# EAGLE schematic Controller Rev 2 (EAGLE 6.1)
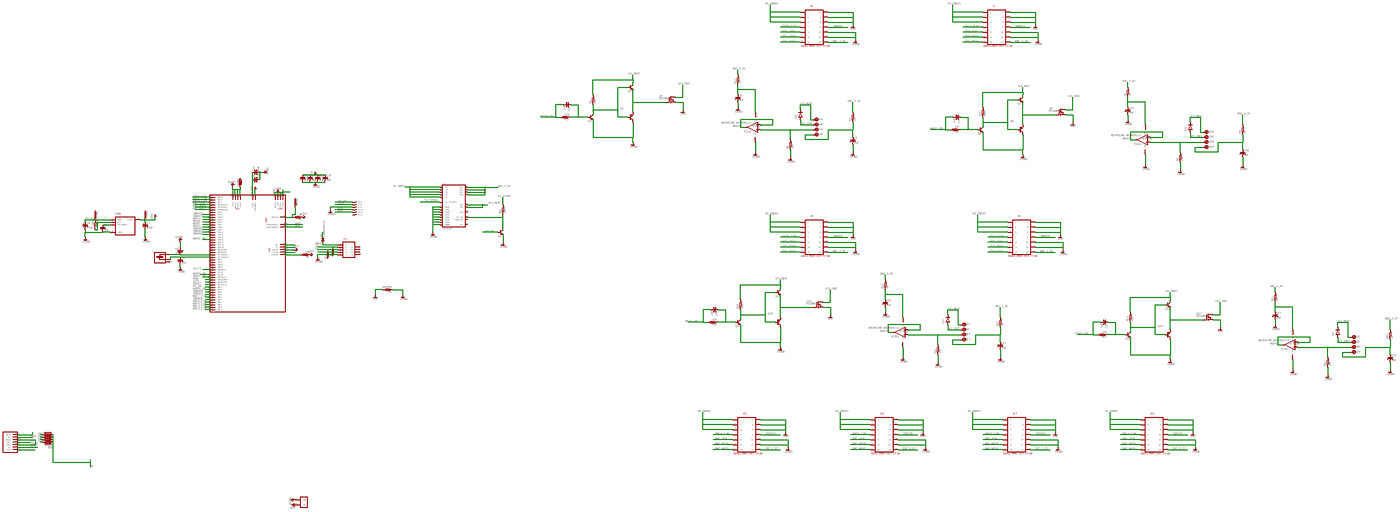
[diagram p0: schematic, sheet 1, overview]
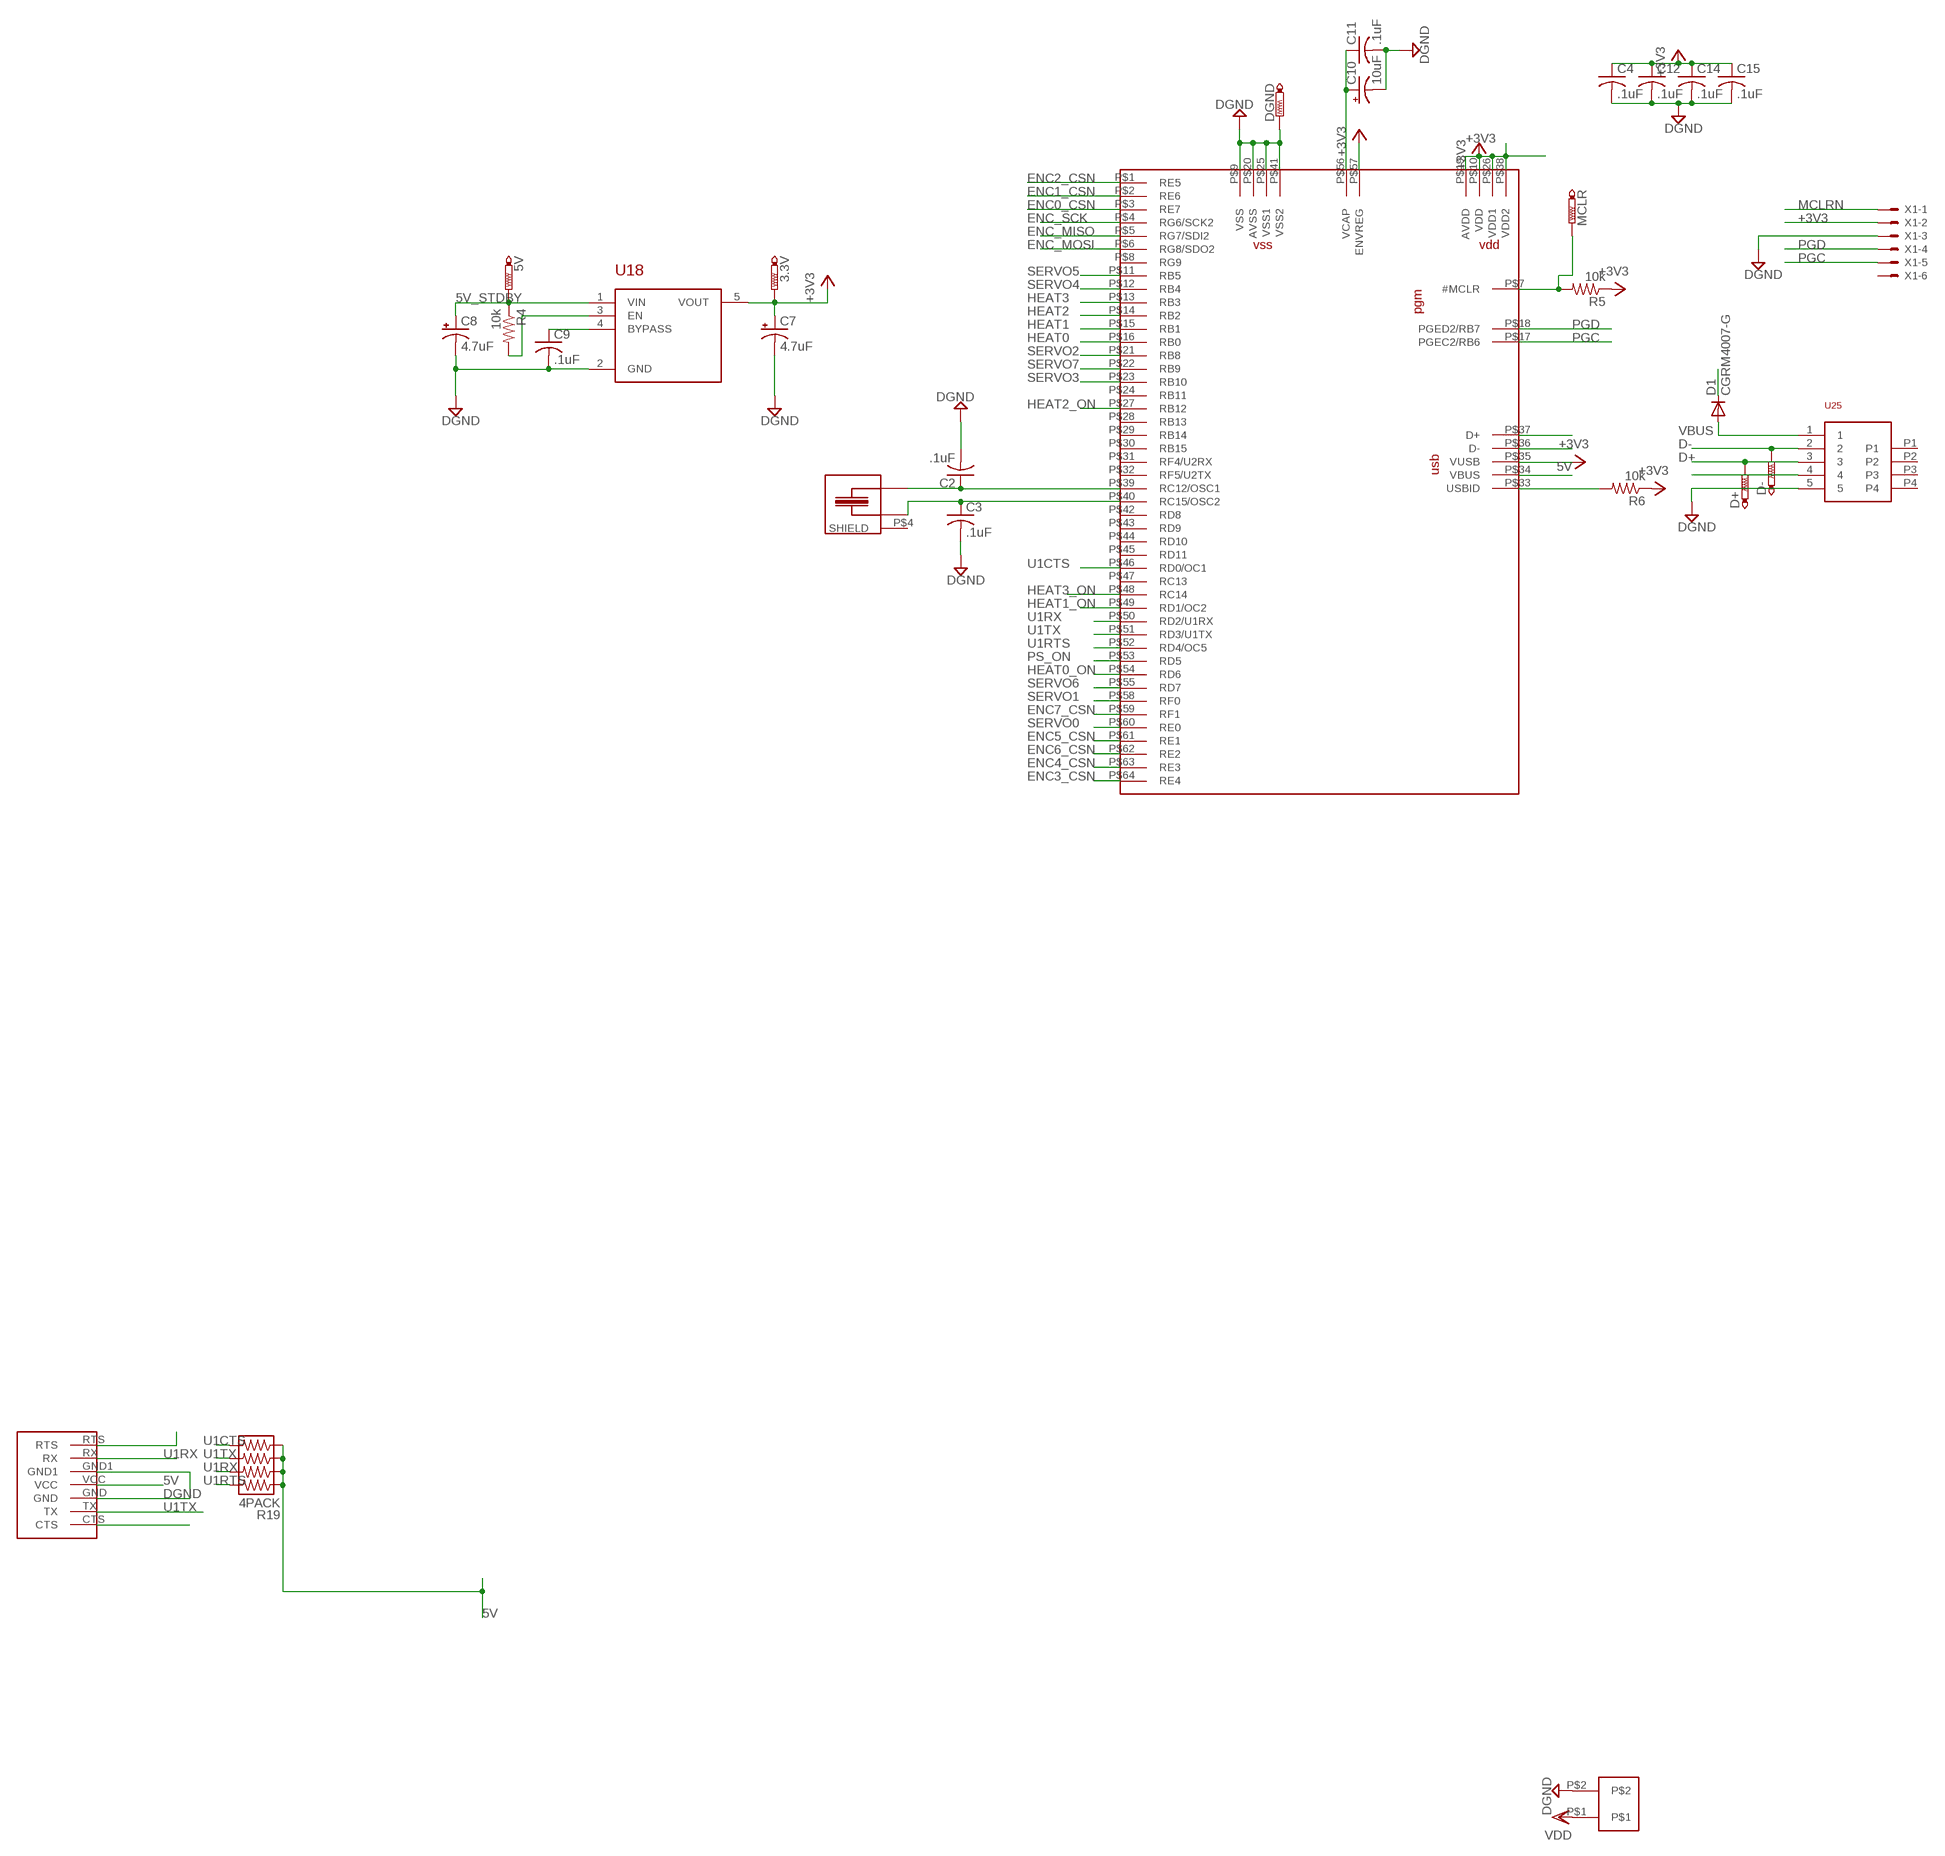
[diagram p1: schematic, sheet 1, part 1 of 4]
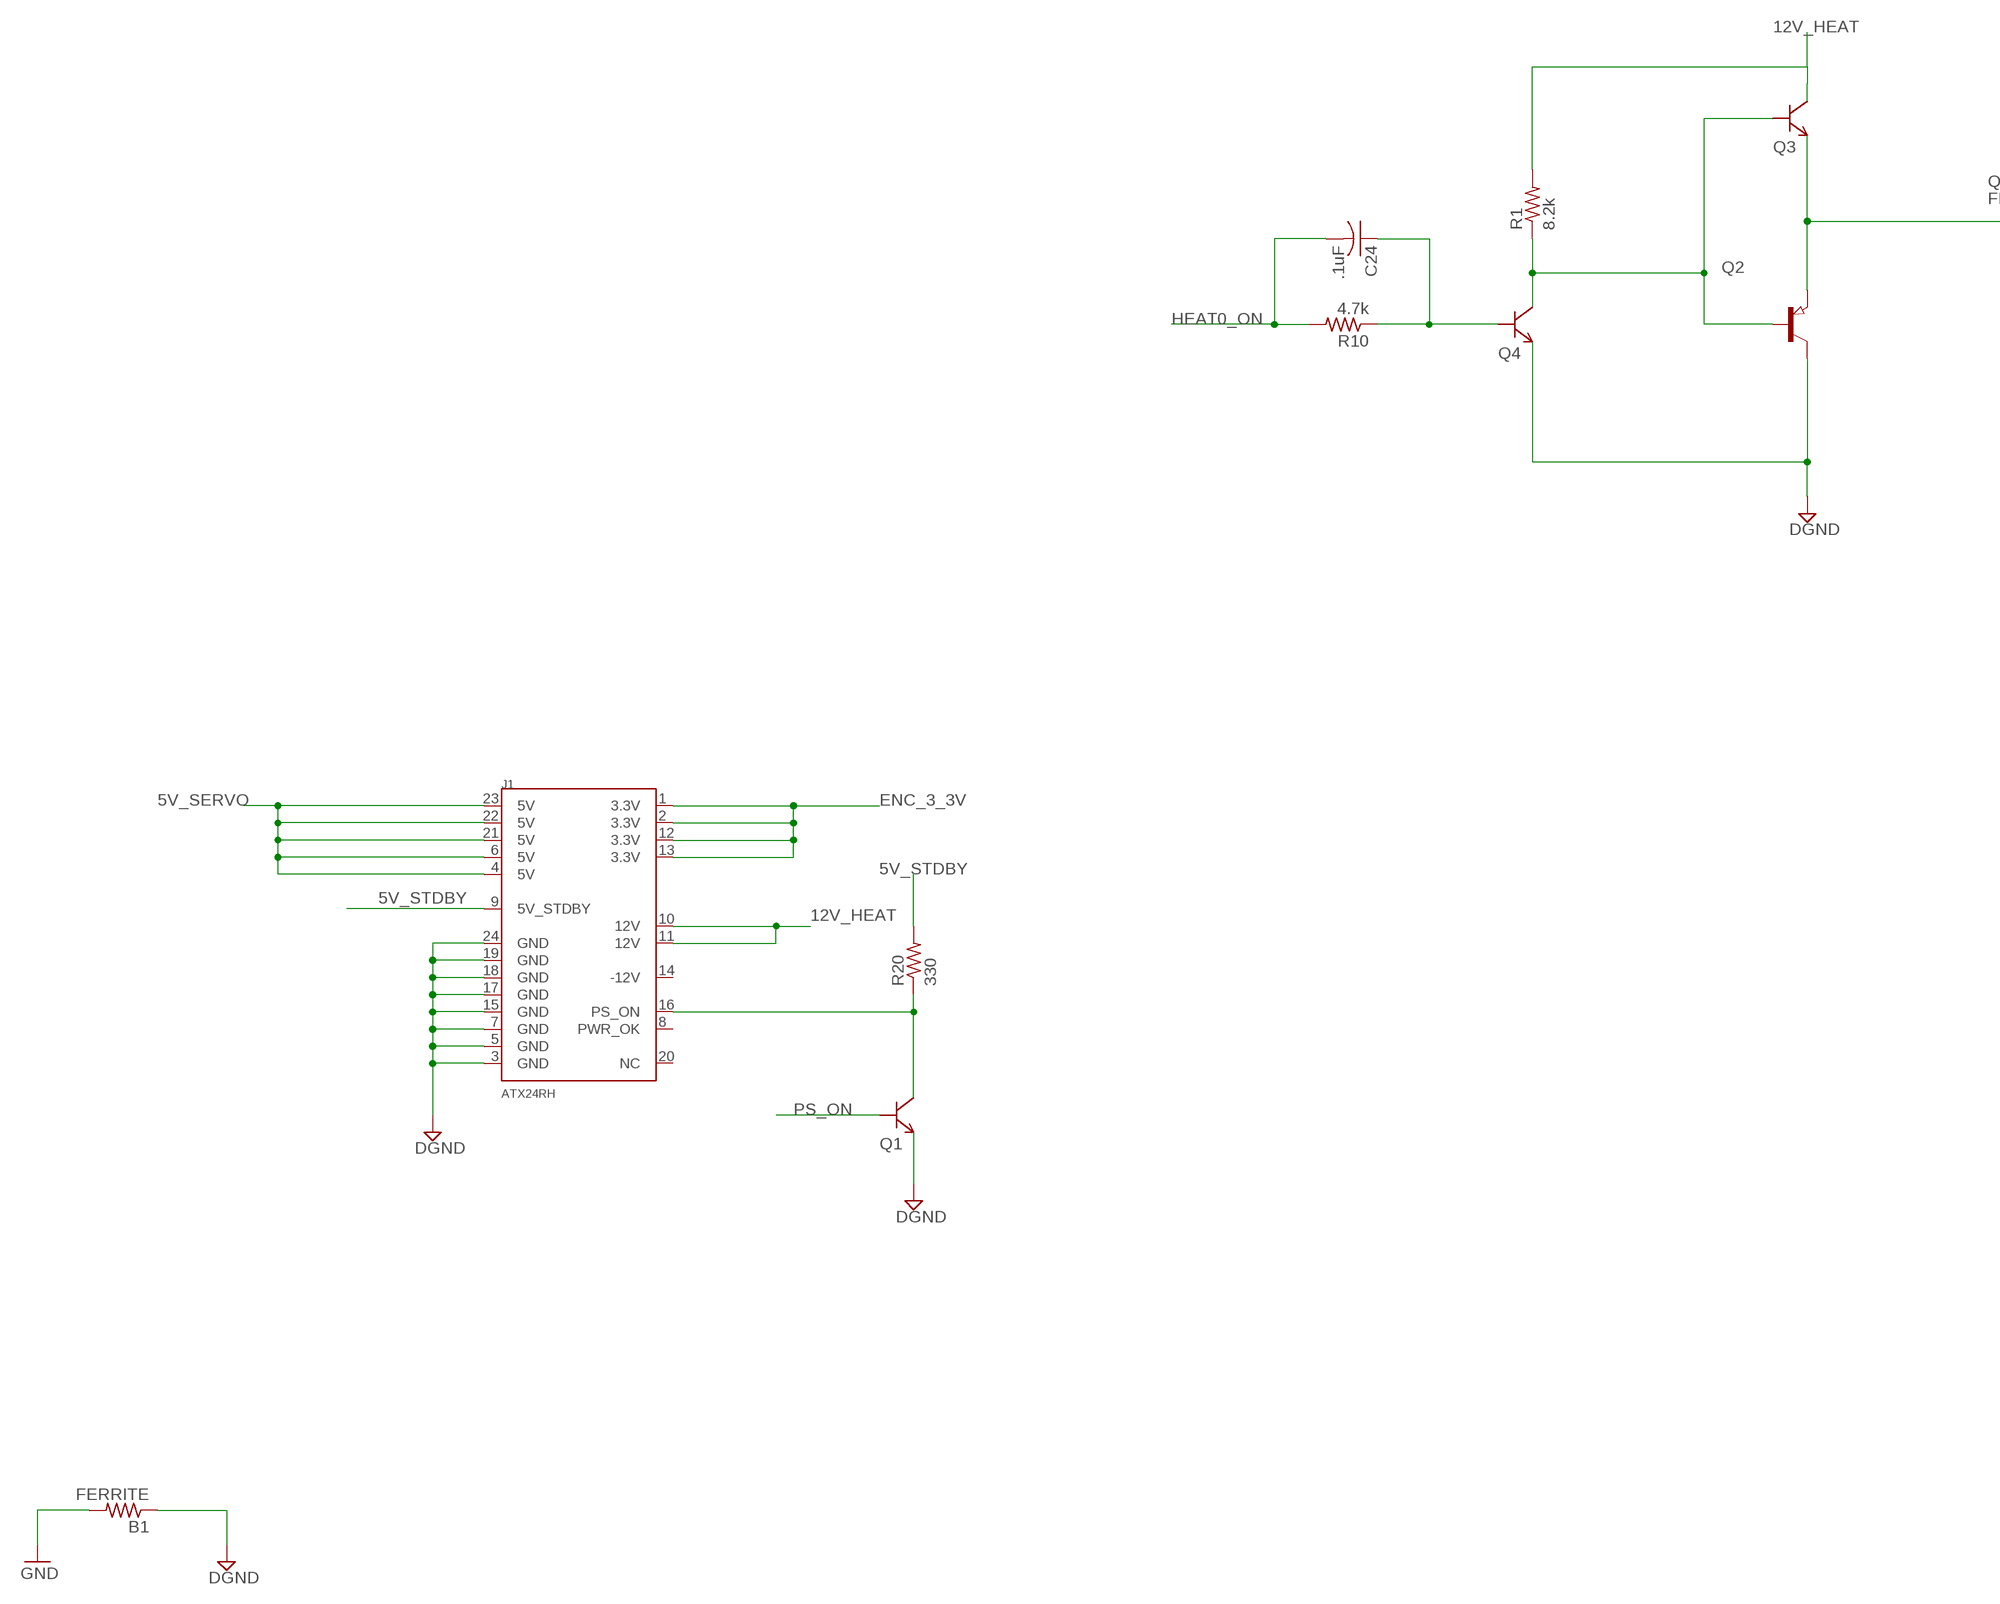
[diagram p2: schematic, sheet 1, part 2 of 4]
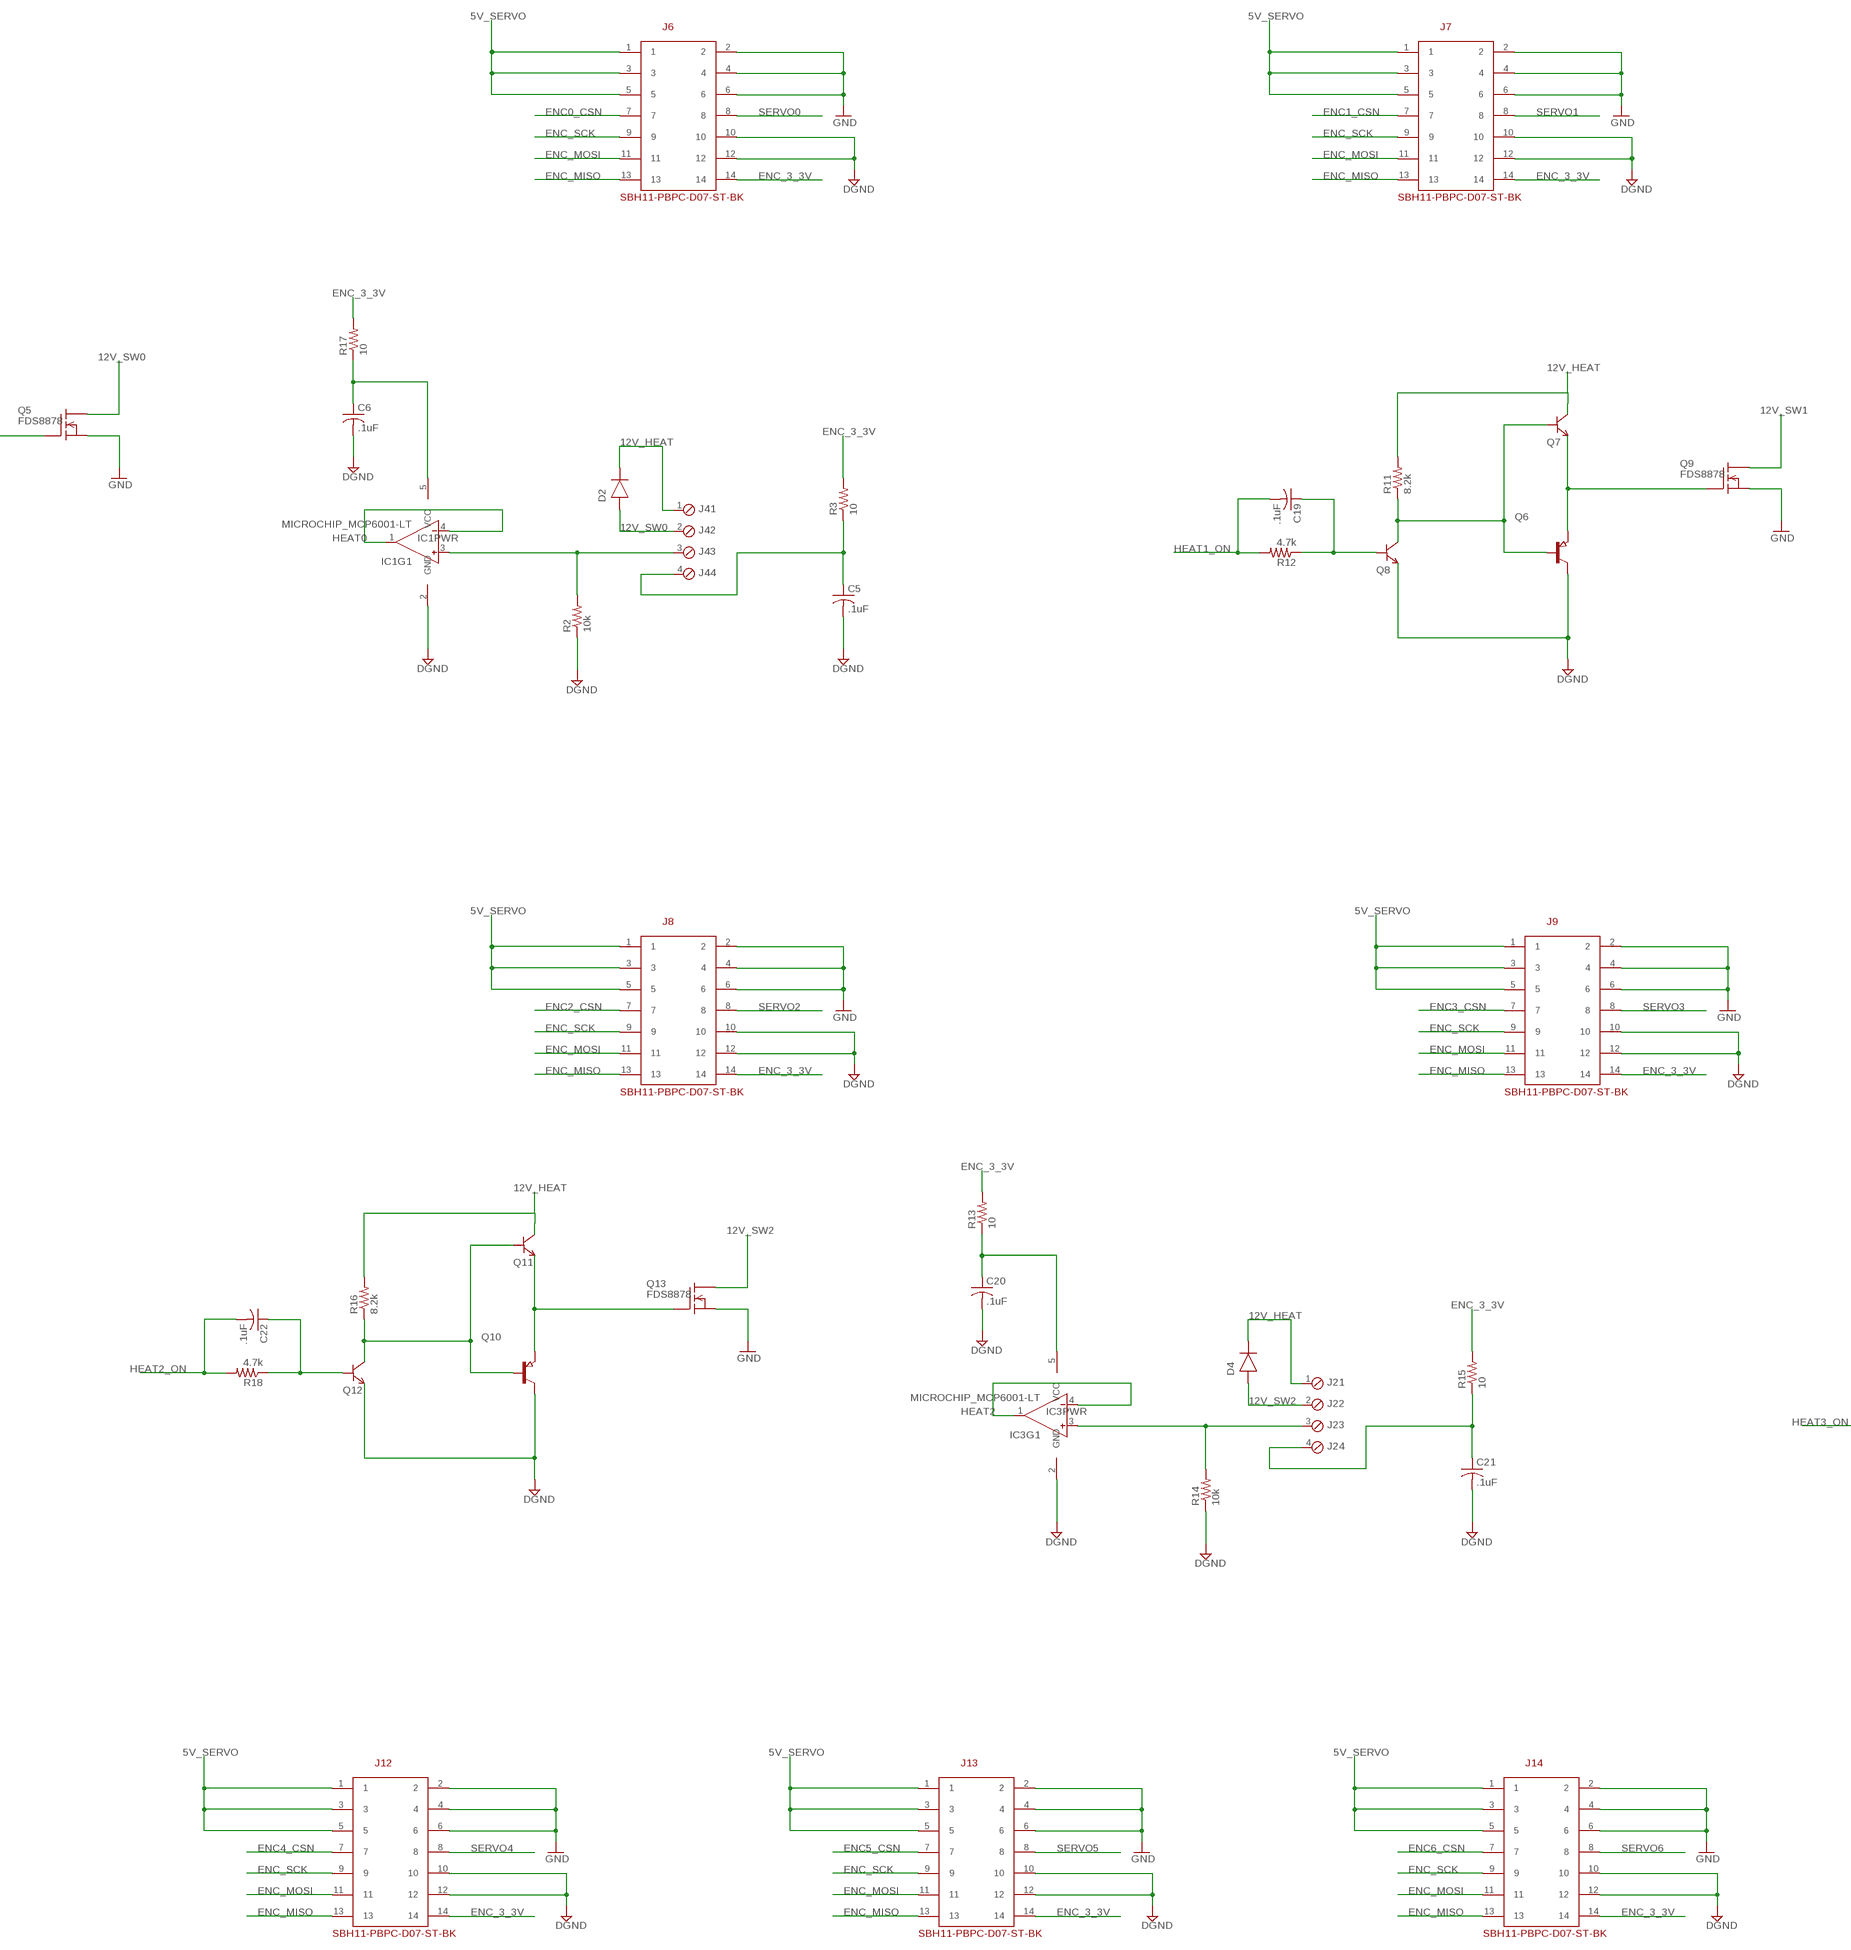
[diagram p3: schematic, sheet 1, part 3 of 4]
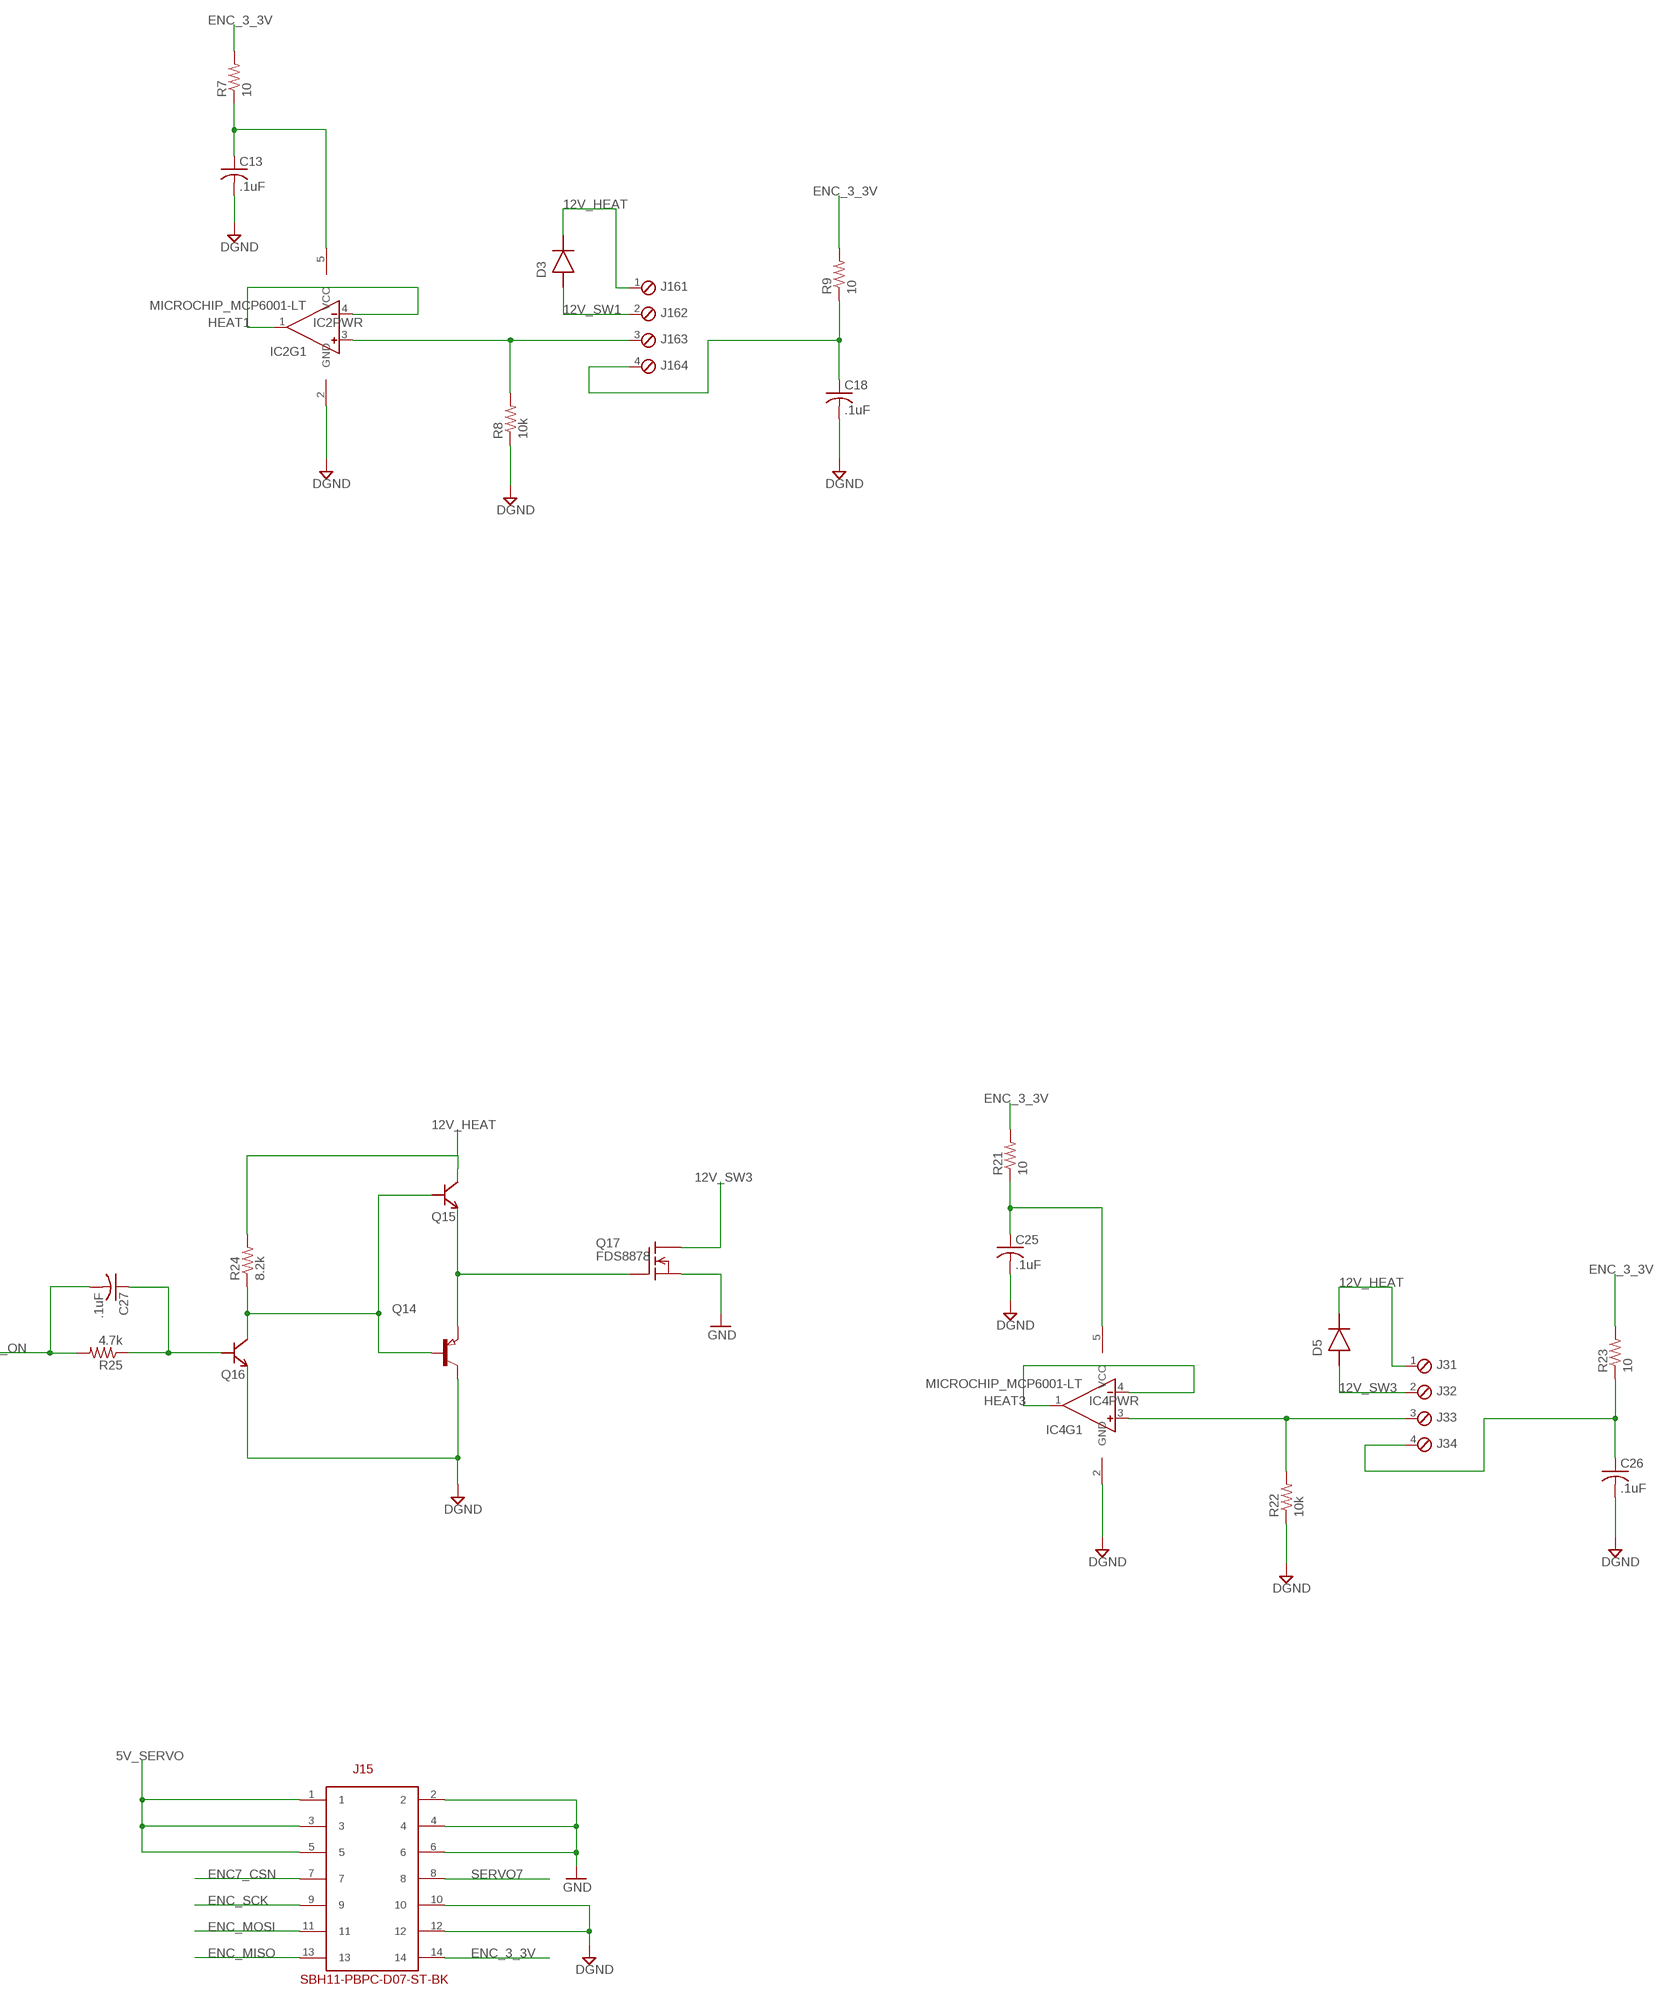
[diagram p4: schematic, sheet 1, part 4 of 4]

## Parts
3.3V  PTR1TP14R  [TP14R]
5V  PTR1TP14R  [TP14R]
B1  FERRITE  R-US_R0603  [R0603]
C2  .1uF  C-USC0603  [C0603]
C3  .1uF  C-USC0603  [C0603]
C4  .1uF  C-USC0603  [C0603]
C5  .1uF  C-USC0603  [C0603]
C6  .1uF  C-USC0603  [C0603]
C7  4.7uF  CPOL-USR/2012-12R  [R/2012-12R]
C8  4.7uF  CPOL-USR/2012-12R  [R/2012-12R]
C9  .1uF  C-USC0402  [C0402]
C10  10uF  CPOL-USR/2012-12R  [R/2012-12R]
C11  .1uF  C-USC0603  [C0603]
C12  .1uF  C-USC0603  [C0603]
C13  .1uF  C-USC0603  [C0603]
C14  .1uF  C-USC0603  [C0603]
C15  .1uF  C-USC0603  [C0603]
C18  .1uF  C-USC0603  [C0603]
C19  .1uF  C-USC0603  [C0603]
C20  .1uF  C-USC0603  [C0603]
C21  .1uF  C-USC0603  [C0603]
C22  .1uF  C-USC0603  [C0603]
C24  .1uF  C-USC0603  [C0603]
C25  .1uF  C-USC0603  [C0603]
C26  .1uF  C-USC0603  [C0603]
C27  .1uF  C-USC0603  [C0603]
D1  CGRM4007-G  [SOD-123_MINI-SMA]
D2  DISCRETE_DIODESMA  [DISCRETE_SMA]
D3  DISCRETE_DIODESMA  [DISCRETE_SMA]
D4  DISCRETE_DIODESMA  [DISCRETE_SMA]
D5  DISCRETE_DIODESMA  [DISCRETE_SMA]
D+  PTR1TP14R  [TP14R]
D-  PTR1TP14R  [TP14R]
DGND  PTR1B1,27  [B1,27]
IC1  MICROCHIP_MCP6001-LT  [MICROCHIP_SC70-5-LT]
IC2  MICROCHIP_MCP6001-LT  [MICROCHIP_SC70-5-LT]
IC3  MICROCHIP_MCP6001-LT  [MICROCHIP_SC70-5-LT]
IC4  MICROCHIP_MCP6001-LT  [MICROCHIP_SC70-5-LT]
J1  ATX24RH  [ATX24_RIGHT_ANGLE]
J2  OSTVN04A150  [4POL254]
J3  OSTVN04A150  [4POL254]
J4  OSTVN04A150  [4POL254]
J6  SBH11-PBPC-D07-ST-BK  [SBH11-PBPC-D07-ST-BK]
J7  SBH11-PBPC-D07-ST-BK  [SBH11-PBPC-D07-ST-BK]
J8  SBH11-PBPC-D07-ST-BK  [SBH11-PBPC-D07-ST-BK]
J9  SBH11-PBPC-D07-ST-BK  [SBH11-PBPC-D07-ST-BK]
J10  WASP7PIN  [WASP7PIN]
J12  SBH11-PBPC-D07-ST-BK  [SBH11-PBPC-D07-ST-BK]
J13  SBH11-PBPC-D07-ST-BK  [SBH11-PBPC-D07-ST-BK]
J14  SBH11-PBPC-D07-ST-BK  [SBH11-PBPC-D07-ST-BK]
J15  SBH11-PBPC-D07-ST-BK  [SBH11-PBPC-D07-ST-BK]
J16  OSTVN04A150  [4POL254]
MCLR  PTR1TP14R  [TP14R]
Q1  DISCRETE_MMBT3904LT1G  [DISCRETE_SOT23]
Q2  PNP-TRANSISTOR_SOT23  [SOT23]
Q3  DISCRETE_MMBT3904LT1G  [DISCRETE_SOT23]
Q4  DISCRETE_MMBT3904LT1G  [DISCRETE_SOT23]
Q5  FDS8878  FDS5680  [SO-8]
Q6  PNP-TRANSISTOR_SOT23  [SOT23]
Q7  DISCRETE_MMBT3904LT1G  [DISCRETE_SOT23]
Q8  DISCRETE_MMBT3904LT1G  [DISCRETE_SOT23]
Q9  FDS8878  FDS5680  [SO-8]
Q10  PNP-TRANSISTOR_SOT23  [SOT23]
Q11  DISCRETE_MMBT3904LT1G  [DISCRETE_SOT23]
Q12  DISCRETE_MMBT3904LT1G  [DISCRETE_SOT23]
Q13  FDS8878  FDS5680  [SO-8]
Q14  PNP-TRANSISTOR_SOT23  [SOT23]
Q15  DISCRETE_MMBT3904LT1G  [DISCRETE_SOT23]
Q16  DISCRETE_MMBT3904LT1G  [DISCRETE_SOT23]
Q17  FDS8878  FDS5680  [SO-8]
R1  8.2k  R-US_R0603  [R0603]
R2  10k  R-US_R0603  [R0603]
R3  10  R-US_R0603  [R0603]
R4  10k  R-US_R0402  [R0402]
R5  10k  R-US_R0603  [R0603]
R6  10k  R-US_R0603  [R0603]
R7  10  R-US_R0603  [R0603]
R8  10k  R-US_R0603  [R0603]
R9  10  R-US_R0603  [R0603]
R10  4.7k  R-US_R0603  [R0603]
R11  8.2k  R-US_R0603  [R0603]
R12  4.7k  R-US_R0603  [R0603]
R13  10  R-US_R0603  [R0603]
R14  10k  R-US_R0603  [R0603]
R15  10  R-US_R0603  [R0603]
R16  8.2k  R-US_R0603  [R0603]
R17  10  R-US_R0603  [R0603]
R18  4.7k  R-US_R0603  [R0603]
R19  4PACK  [4PACK_0603]
R20  330  R-US_R0603  [R0603]
R21  10  R-US_R0603  [R0603]
R22  10k  R-US_R0603  [R0603]
R23  10  R-US_R0603  [R0603]
R24  8.2k  R-US_R0603  [R0603]
R25  4.7k  R-US_R0603  [R0603]
U3  PIC32-64TQFP64-2  [TQFP64-2]
U18  LDS3985XX33  [SOT23-5]
U25  1734035-1_USB  [1734035-1_1734035]
U$19  2P  [2PTH]
X1  22-23-2061  [22-23-2061]
X2  CMR3XXT  [CMR309T]

## Nets
5V: D1.C J10.VCC R19.R1B R19.R2B R19.R3B R19.R4B U3.P$34(VBUS)
5V_SERVO: J1.4(5V) J1.6(5V) J1.21(5V) J1.22(5V) J1.23(5V) J6.1 J6.3 J6.5 J7.1 J7.3 J7.5 J8.1 J8.3 J8.5 J9.1 J9.3 J9.5 J12.1 J12.3 J12.5 J13.1 J13.3 J13.5 J14.1 J14.3 J14.5 J15.1 J15.3 J15.5
5V_STDBY: 5V.TP C8.+ J1.9(5V_STDBY) R4.1 R20.2 U18.1(VIN)
12V_HEAT: D2.C D3.C D4.C D5.C J1.10(12V) J1.11(12V) J2.1 J3.1 J4.1 J16.1 Q3.3(C) Q7.3(C) Q11.3(C) Q15.3(C) R1.2 R11.2 R16.2 R24.2
12V_SW0: D2.A J4.2 Q5.5(D) Q5.6(D) Q5.7(D) Q5.8(D)
12V_SW1: D3.A J16.2 Q9.5(D) Q9.6(D) Q9.7(D) Q9.8(D)
12V_SW2: D4.A J2.2 Q13.5(D) Q13.6(D) Q13.7(D) Q13.8(D)
12V_SW3: D5.A J3.2 Q17.5(D) Q17.6(D) Q17.7(D) Q17.8(D)
+3V3: 3.3V.TP C4.1 C7.+ C12.1 C14.1 C15.1 R5.1 R6.1 U3.P$10(VDD) U3.P$19(AVDD) U3.P$26(VDD1) U3.P$35(VUSB) U3.P$38(VDD2) U3.P$57(ENVREG) U18.5(VOUT) X1.2
D+: D+.TP U3.P$37(D+) U25.3
D-: D-.TP U3.P$36(D-) U25.2
DGND: B1.1 C2.2 C3.2 C4.2 C5.2 C6.2 C7.- C8.- C9.2 C10.- C11.2 C12.2 C13.2 C14.2 C15.2 C18.2 C20.2 C21.2 C25.2 C26.2 DGND.PP(TP) IC1.2(PWR:GND) IC2.2(PWR:GND) IC3.2(PWR:GND) IC4.2(PWR:GND) J1.3(GND) J1.5(GND) J1.7(GND) J1.15(GND) J1.17(GND) J1.18(GND) J1.19(GND) J1.24(GND) J6.10 J6.12 J7.10 J7.12 J8.10 J8.12 J9.10 J9.12 J10.GND J10.GND1 J12.10 J12.12 J13.10 J13.12 J14.10 J14.12 J15.10 J15.12 Q1.2(E) Q2.3(C) Q4.2(E) Q6.3(C) Q8.2(E) Q10.3(C) Q12.2(E) Q14.3(C) Q16.2(E) R2.1 R8.1 R14.1 R22.1 U3.P$9(VSS) U3.P$20(AVSS) U3.P$25(VSS1) U3.P$41(VSS2) U18.2(GND) U25.5 U$19.P$2 X1.3
ENC0_CSN: J6.7 U3.P$3(RE7)
ENC1_CSN: J7.7 U3.P$2(RE6)
ENC2_CSN: J8.7 U3.P$1(RE5)
ENC3_CSN: J9.7 U3.P$64(RE4)
ENC4_CSN: J12.7 U3.P$63(RE3)
ENC5_CSN: J13.7 U3.P$61(RE1)
ENC6_CSN: J14.7 U3.P$62(RE2)
ENC7_CSN: J15.7 U3.P$59(RF1)
ENC_3_3V: J1.1(3.3V) J1.2(3.3V) J1.12(3.3V) J1.13(3.3V) J6.14 J7.14 J8.14 J9.14 J12.14 J13.14 J14.14 J15.14 R3.2 R7.2 R9.2 R13.2 R15.2 R17.2 R21.2 R23.2
ENC_MISO: J6.13 J7.13 J8.13 J9.13 J12.13 J13.13 J14.13 J15.13 U3.P$5(RG7/SDI2)
ENC_MOSI: J6.11 J7.11 J8.11 J9.11 J12.11 J13.11 J14.11 J15.11 U3.P$6(RG8/SDO2)
ENC_SCK: J6.9 J7.9 J8.9 J9.9 J12.9 J13.9 J14.9 J15.9 U3.P$4(RG6/SCK2)
GND: B1.2 J6.2 J6.4 J6.6 J7.2 J7.4 J7.6 J8.2 J8.4 J8.6 J9.2 J9.4 J9.6 J12.2 J12.4 J12.6 J13.2 J13.4 J13.6 J14.2 J14.4 J14.6 J15.2 J15.4 J15.6 Q5.1(S) Q5.2(S) Q5.3(S) Q9.1(S) Q9.2(S) Q9.3(S) Q13.1(S) Q13.2(S) Q13.3(S) Q17.1(S) Q17.2(S) Q17.3(S)
HEAT0: IC1.1(OUT) IC1.4(IN-) U3.P$16(RB0)
HEAT0_ON: C24.2 R10.2 U3.P$54(RD6)
HEAT1: IC2.1(OUT) IC2.4(IN-) U3.P$15(RB1)
HEAT1_ON: C19.2 R12.2 U3.P$49(RD1/OC2)
HEAT2: IC3.1(OUT) IC3.4(IN-) U3.P$14(RB2)
HEAT2_ON: C22.2 R18.2 U3.P$27(RB12)
HEAT3: IC4.1(OUT) IC4.4(IN-) U3.P$13(RB3)
HEAT3_ON: C27.2 R25.2 U3.P$48(RC14)
MCLRN: MCLR.TP R5.2 U3.P$7(#MCLR) X1.1
N$1: C5.1 J4.4 R3.1
N$2: R4.2 U18.3(EN)
N$3: C9.1 U18.4(BYPASS)
N$4: C3.1 U3.P$40(RC15/OSC2) X2.P$3
N$5: C10.+ C11.1 U3.P$56(VCAP)
N$6: C2.1 U3.P$39(RC12/OSC1) X2.P$1
N$7: IC2.3(IN+) J16.3 R8.2
N$8: C13.1 IC2.5(PWR:VCC) R7.1
N$9: C18.1 J16.4 R9.1
N$10: IC1.3(IN+) J4.3 R2.2
N$11: Q6.1(B) Q7.1(B) Q8.3(C) R11.1
N$12: C19.1 Q8.1(B) R12.1
N$13: Q2.1(B) Q3.1(B) Q4.3(C) R1.1
N$14: C24.1 Q4.1(B) R10.1
N$15: Q6.2(E) Q7.2(E) Q9.4(G)
N$16: Q2.2(E) Q3.2(E) Q5.4(G)
N$17: IC3.3(IN+) J2.3 R14.2
N$18: C20.1 IC3.5(PWR:VCC) R13.1
N$19: C21.1 J2.4 R15.1
N$20: Q10.1(B) Q11.1(B) Q12.3(C) R16.1
N$21: C6.1 IC1.5(PWR:VCC) R17.1
N$22: C22.1 Q12.1(B) R18.1
N$23: Q10.2(E) Q11.2(E) Q13.4(G)
N$24: IC4.3(IN+) J3.3 R22.2
N$25: C25.1 IC4.5(PWR:VCC) R21.1
N$26: C26.1 J3.4 R23.1
N$27: Q14.1(B) Q15.1(B) Q16.3(C) R24.1
N$28: C27.1 Q16.1(B) R25.1
N$29: Q14.2(E) Q15.2(E) Q17.4(G)
N$32: J1.16(PS_ON) Q1.3(C) R20.1
PGC: U3.P$17(PGEC2/RB6) X1.5
PGD: U3.P$18(PGED2/RB7) X1.4
PS_ON: Q1.1(B) U3.P$53(RD5)
SERVO0: J6.8 U3.P$60(RE0)
SERVO1: J7.8 U3.P$58(RF0)
SERVO2: J8.8 U3.P$21(RB8)
SERVO3: J9.8 U3.P$23(RB10)
SERVO4: J12.8 U3.P$12(RB4)
SERVO5: J13.8 U3.P$11(RB5)
SERVO6: J14.8 U3.P$55(RD7)
SERVO7: J15.8 U3.P$22(RB9)
U1CTS: J10.CTS R19.R4A U3.P$46(RD0/OC1)
U1RTS: J10.RTS R19.R1A U3.P$52(RD4/OC5)
U1RX: J10.RX R19.R2A U3.P$50(RD2/U1RX)
U1TX: J10.TX R19.R3A U3.P$51(RD3/U1TX)
USBID: R6.2 U3.P$33(USBID) U25.4
VBUS: D1.A U25.1
VDD: U$19.P$1
Unconnected: J1.8(PWR_OK) J1.14(-12V) J1.20(NC) U3.P$8(RG9) U3.P$24(RB11) U3.P$28(RB13) U3.P$29(RB14) U3.P$30(RB15) U3.P$31(RF4/U2RX) U3.P$32(RF5/U2TX) U3.P$42(RD8) U3.P$43(RD9) U3.P$44(RD10) U3.P$45(RD11) U3.P$47(RC13) U25.P1 U25.P2 U25.P3 U25.P4 X1.6 X2.P$4(SHIELD)

## Library data of the parts
3.3V 5V D+ D- DGND MCLR = testpad:PTR1: TEST PIN
B1 R1-R18 R20-R25 = rcl:R-US_: RESISTOR, American symbol
C2-C6 C9 C11-C15 C18-C22 C24-C27 = rcl:C-US: CAPACITOR, American symbol
C7 C8 C10 = rcl:CPOL-US: POLARIZED CAPACITOR, American symbol
D1 = diode:CGRM400*-G: Molded plasitc,JEDEC SOD-123/Mini SMA Source: Comchip CGRM4001-G.pdf
D2-D5 = chipKIT_Max32:DISCRETE_DIODE: Diode
IC1-IC4 = chipKIT_Max32:MICROCHIP_MCP6001: 1 Mhz Low Power Op Amp
J1 = SparkFun-Connectors:ATX24: ATX24 Pin Power Supply Connector This is a good connector for connecting a computer power supply to a PCB. It's massive, but provides many amps of power at 5V and 12V. SKU: PRT-09498
J2-J4 J16 = con-OST-254:OSTVN04A150
J6-J9 J12-J15 = SBH11-PBPC-D07-ST-BK:SBH11-PBPC-D07-ST-BK
J10 = wasp7pin:WASP7PIN
Q1 Q3 Q4 Q7 Q8 Q11 Q12 Q15 Q16 = chipKIT_Max32:DISCRETE_MMBT3904: General Purpose NPN Transistor
Q2 Q6 Q10 Q14 = semicon-smd-ipc:PNP-TRANSISTOR_: PNP TRANSISTOR
Q5 Q9 Q13 Q17 = transistor-fet:FDS5680: 60V N-Channel PowerTrench TM MOSFET FAIRCHILD FDS5680.pdf
R19 = ResistorBlocks:4PACK: This is a 0603x4 resistor block. Digikey PN:MNR14103RCT-ND
U3 = pic32:PIC32-64
U18 = LDS3985XX33:LDS3985XX33
U25 = YESIN_USB:1734035-1_USB
U$19 = con_2h_70555-0001:2P
X1 = con-molex:22-23-2061: .100" (2.54mm) Center Header - 6 Pin; MF: MOLEX; MPN: 22-23-2061; OC_FARNELL: 1462922; OC_NEWARK: 27C1933
X2 = cmr3XXT:CMR3XXT